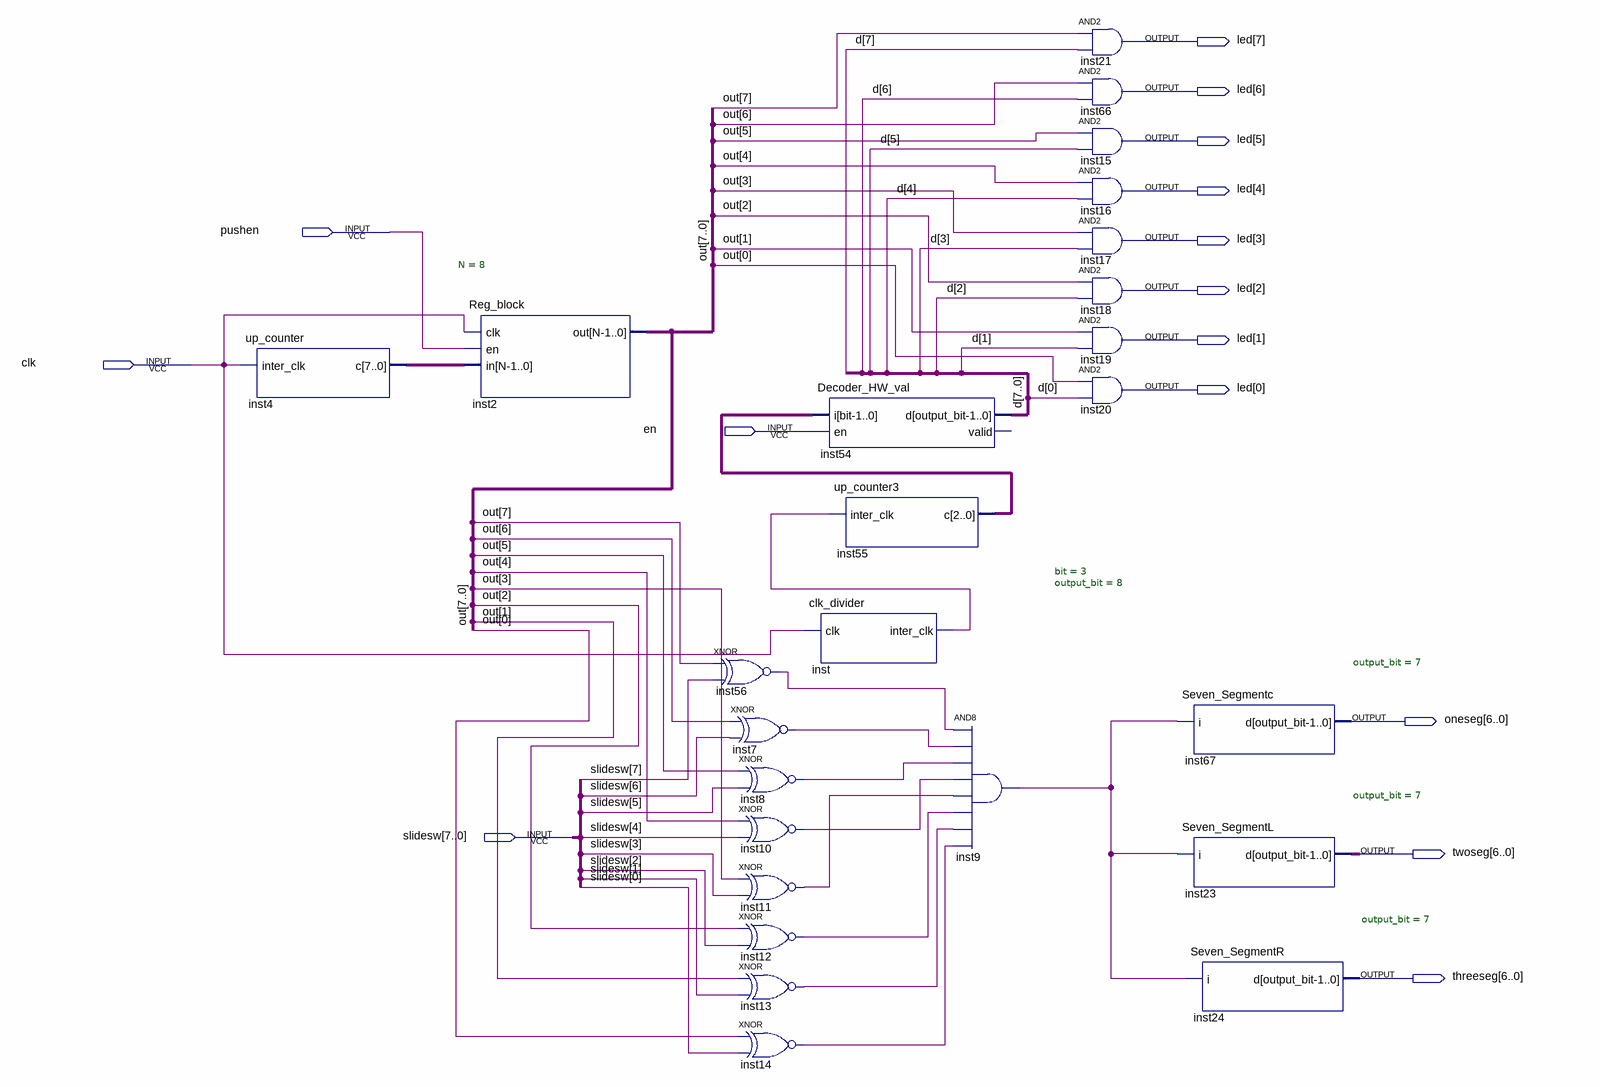
[diagram p0: schematic sheet]
// Quartus schematic folder.bdf as structural Verilog: 25 symbols, 15 pins
module folder (
  input  pushen,
  input  clk,
  input  en,
  input  [7:0] slidesw,
  output [7:0] led,
  output [6:0] oneseg,
  output [6:0] twoseg,
  output [6:0] threeseg
);

  wire inst7_out, inst8_out, inst9_out, inst10_out, inst11_out, inst12_out, inst13_out, inst14_out,
       inst56_out, inst_inter_clk;
  wire [2:0] inst55_c;
  wire [7:0] d, inst4_c, out;

  up_counter inst4 (.inter_clk(clk), .c(inst4_c));
  Reg_block #(.N(8)) inst2 (.clk(clk), .en(pushen), .in(inst4_c), .out(out));
  xnor inst56 (inst56_out, out[7], slidesw[7]);
  xnor inst7 (inst7_out, out[6], slidesw[6]);
  xnor inst8 (inst8_out, out[5], slidesw[5]);
  xnor inst10 (inst10_out, out[4], slidesw[4]);
  xnor inst11 (inst11_out, out[3], slidesw[3]);
  xnor inst12 (inst12_out, out[2], slidesw[2]);
  xnor inst13 (inst13_out, out[1], slidesw[1]);
  xnor inst14 (inst14_out, out[0], slidesw[0]);
  Decoder_HW_val #(.\bit (3), .output_bit(8)) inst54 (.i(inst55_c), .en(en), .d(d));  // open: valid
  clk_divider inst (.clk(clk), .inter_clk(inst_inter_clk));
  up_counter3 inst55 (.inter_clk(inst_inter_clk), .c(inst55_c));
  and inst9 (inst9_out, inst56_out, inst7_out, inst8_out, inst10_out, inst11_out, inst12_out, inst13_out, inst14_out);
  and inst21 (led[7], out[7], d[7]);
  and inst66 (led[6], out[6], d[6]);
  and inst15 (led[5], out[5], d[5]);
  and inst16 (led[4], out[4], d[4]);
  and inst17 (led[3], out[3], d[3]);
  and inst18 (led[2], out[2], d[2]);
  and inst19 (led[1], out[1], d[1]);
  and inst20 (led[0], out[0], d[0]);
  Seven_Segmentc #(.output_bit(7)) inst67 (.i(inst9_out), .d(oneseg));
  Seven_SegmentL #(.output_bit(7)) inst23 (.i(inst9_out), .d(twoseg));
  Seven_SegmentR #(.output_bit(7)) inst24 (.i(inst9_out), .d(threeseg));
endmodule
